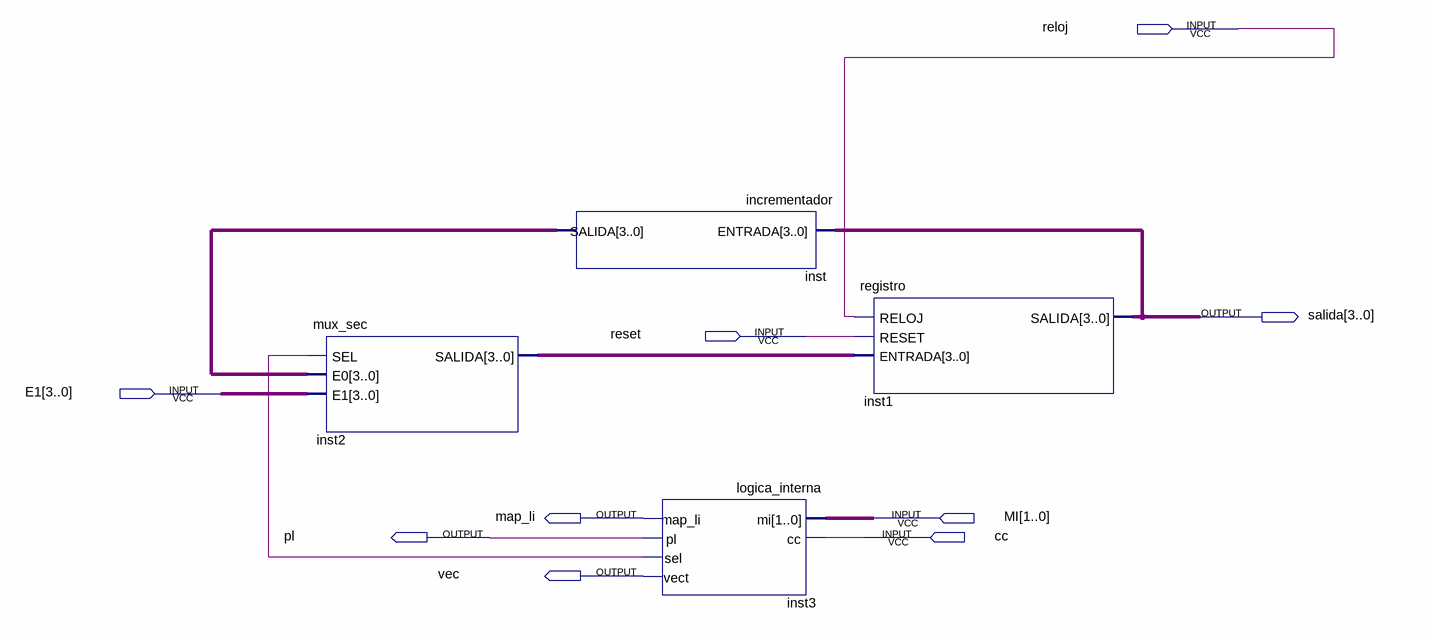
[diagram p0: schematic sheet]
// Quartus schematic secuenciador_dia.bdf as structural Verilog: 4 symbols, 9 pins
module secuenciador_dia (
  input  reloj,
  input  reset,
  input  [3:0] E1,
  input  [1:0] MI,
  input  cc,
  output [3:0] salida,
  output map_li,
  output pl,
  output vec
);

  wire inst3_sel;
  wire [3:0] inst2_salida, inst_salida;

  mux_sec inst2 (.SEL(inst3_sel), .E0(inst_salida), .E1(E1), .SALIDA(inst2_salida));
  incrementador inst (.ENTRADA(salida), .SALIDA(inst_salida));
  logica_interna inst3 (.mi(MI), .cc(cc), .map_li(map_li), .pl(pl), .sel(inst3_sel), .vect(vec));
  registro inst1 (.RELOJ(reloj), .RESET(reset), .ENTRADA(inst2_salida), .SALIDA(salida));
endmodule
